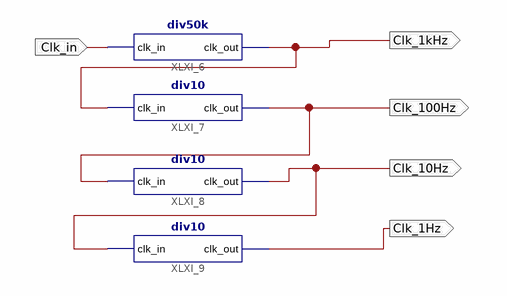
[diagram p0: schematic sheet 1]
// Xilinx ISE schematic divisor.sch (spartan3e) as structural Verilog: 4 symbols, 5 ports
module divisor (
  input  Clk_in,
  output Clk_1Hz,
  output Clk_10Hz,
  output Clk_100Hz,
  output Clk_1kHz
);

  div50k XLXI_6 (.clk_in(Clk_in), .clk_out(Clk_1kHz));
  div10 XLXI_7 (.clk_in(Clk_1kHz), .clk_out(Clk_100Hz));
  div10 XLXI_8 (.clk_in(Clk_100Hz), .clk_out(Clk_10Hz));
  div10 XLXI_9 (.clk_in(Clk_10Hz), .clk_out(Clk_1Hz));
endmodule
